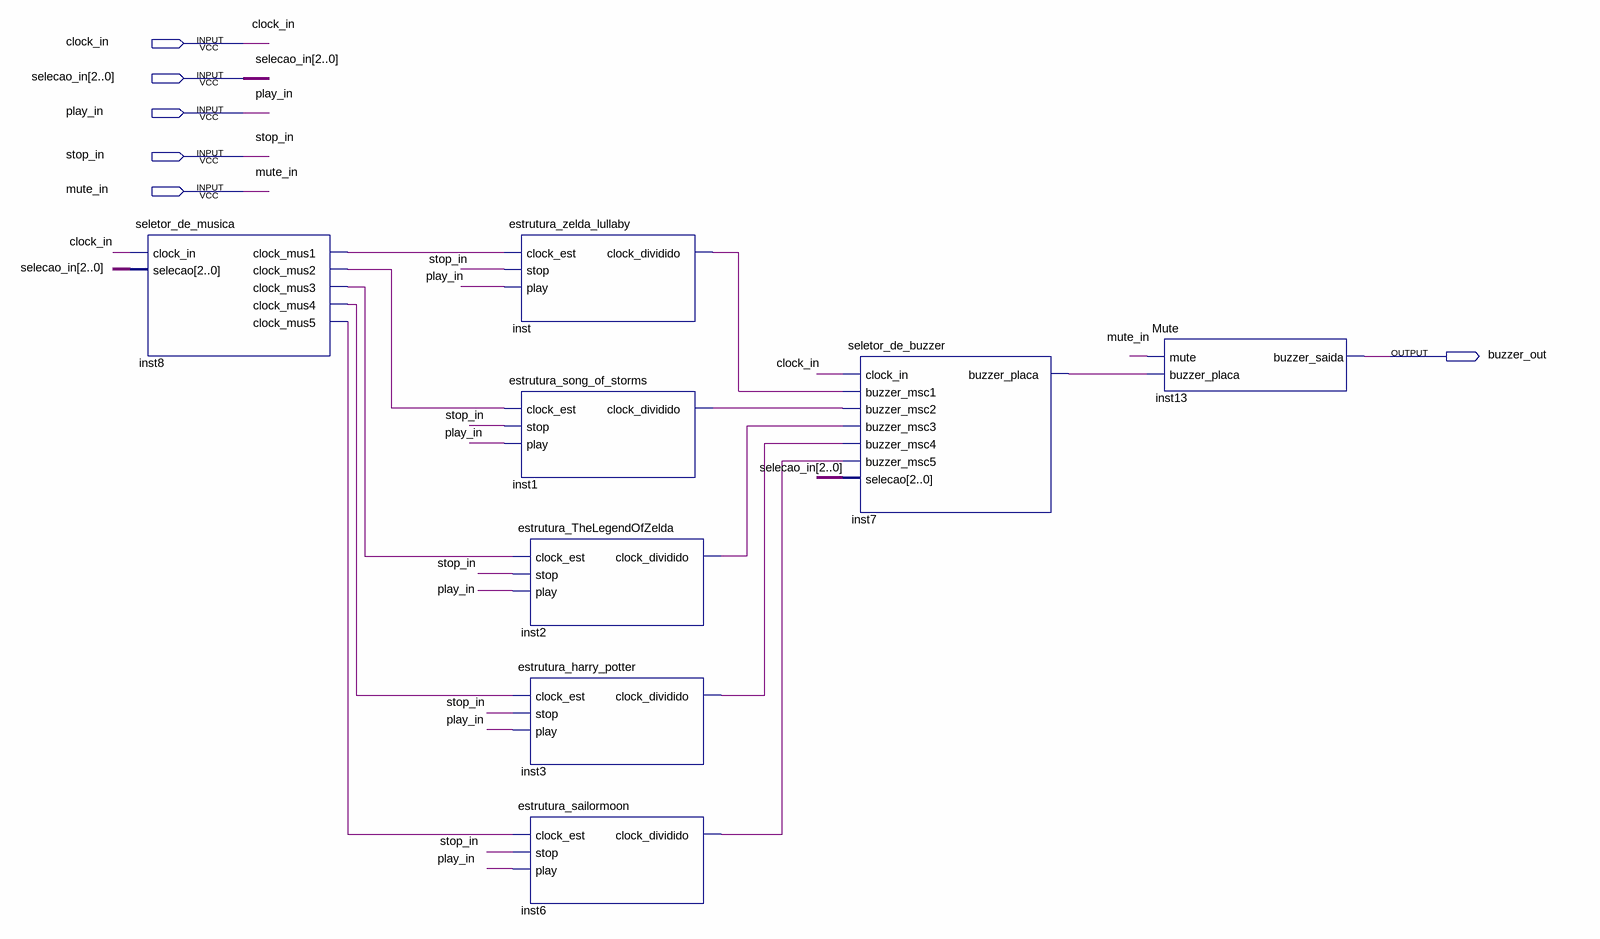
[diagram p0: schematic sheet]
// Quartus schematic bloco_musicas_e_mute.bdf as structural Verilog: 8 symbols, 6 pins
module bloco_musicas_e_mute (
  input  clock_in,
  input  [2:0] selecao_in,
  input  play_in,
  input  stop_in,
  input  mute_in,
  output buzzer_out
);

  wire inst1_clock_dividido, inst2_clock_dividido, inst3_clock_dividido, inst6_clock_dividido,
       inst7_buzzer_placa, inst8_clock_mus1, inst8_clock_mus2, inst8_clock_mus3, inst8_clock_mus4,
       inst8_clock_mus5, inst_clock_dividido;

  seletor_de_musica inst8 (
    .clock_in(clock_in), .selecao(selecao_in), .clock_mus1(inst8_clock_mus1), .clock_mus2(inst8_clock_mus2),
    .clock_mus3(inst8_clock_mus3), .clock_mus4(inst8_clock_mus4), .clock_mus5(inst8_clock_mus5));
  estrutura_zelda_lullaby inst (
    .clock_est(inst8_clock_mus1), .stop(stop_in), .play(play_in), .clock_dividido(inst_clock_dividido));
  estrutura_song_of_storms inst1 (
    .clock_est(inst8_clock_mus2), .stop(stop_in), .play(play_in), .clock_dividido(inst1_clock_dividido));
  estrutura_TheLegendOfZelda inst2 (
    .clock_est(inst8_clock_mus3), .stop(stop_in), .play(play_in), .clock_dividido(inst2_clock_dividido));
  estrutura_harry_potter inst3 (
    .clock_est(inst8_clock_mus4), .stop(stop_in), .play(play_in), .clock_dividido(inst3_clock_dividido));
  estrutura_sailormoon inst6 (
    .clock_est(inst8_clock_mus5), .stop(stop_in), .play(play_in), .clock_dividido(inst6_clock_dividido));
  seletor_de_buzzer inst7 (
    .clock_in(clock_in), .buzzer_msc1(inst_clock_dividido), .buzzer_msc2(inst1_clock_dividido),
    .buzzer_msc3(inst2_clock_dividido), .buzzer_msc4(inst3_clock_dividido),
    .buzzer_msc5(inst6_clock_dividido), .selecao(selecao_in), .buzzer_placa(inst7_buzzer_placa));
  Mute inst13 (.mute(mute_in), .buzzer_placa(inst7_buzzer_placa), .buzzer_saida(buzzer_out));
endmodule
